# Altium schematic sheet Power_1.SchDoc
size A4; CompanyName: TH Nürnberg; Organization: UltraZohm; Address1: Kesslerplatz 12; Address2: 90489 Nürnberg; Address3: GERMANY; SheetNumber: 10; SheetTotal: 10
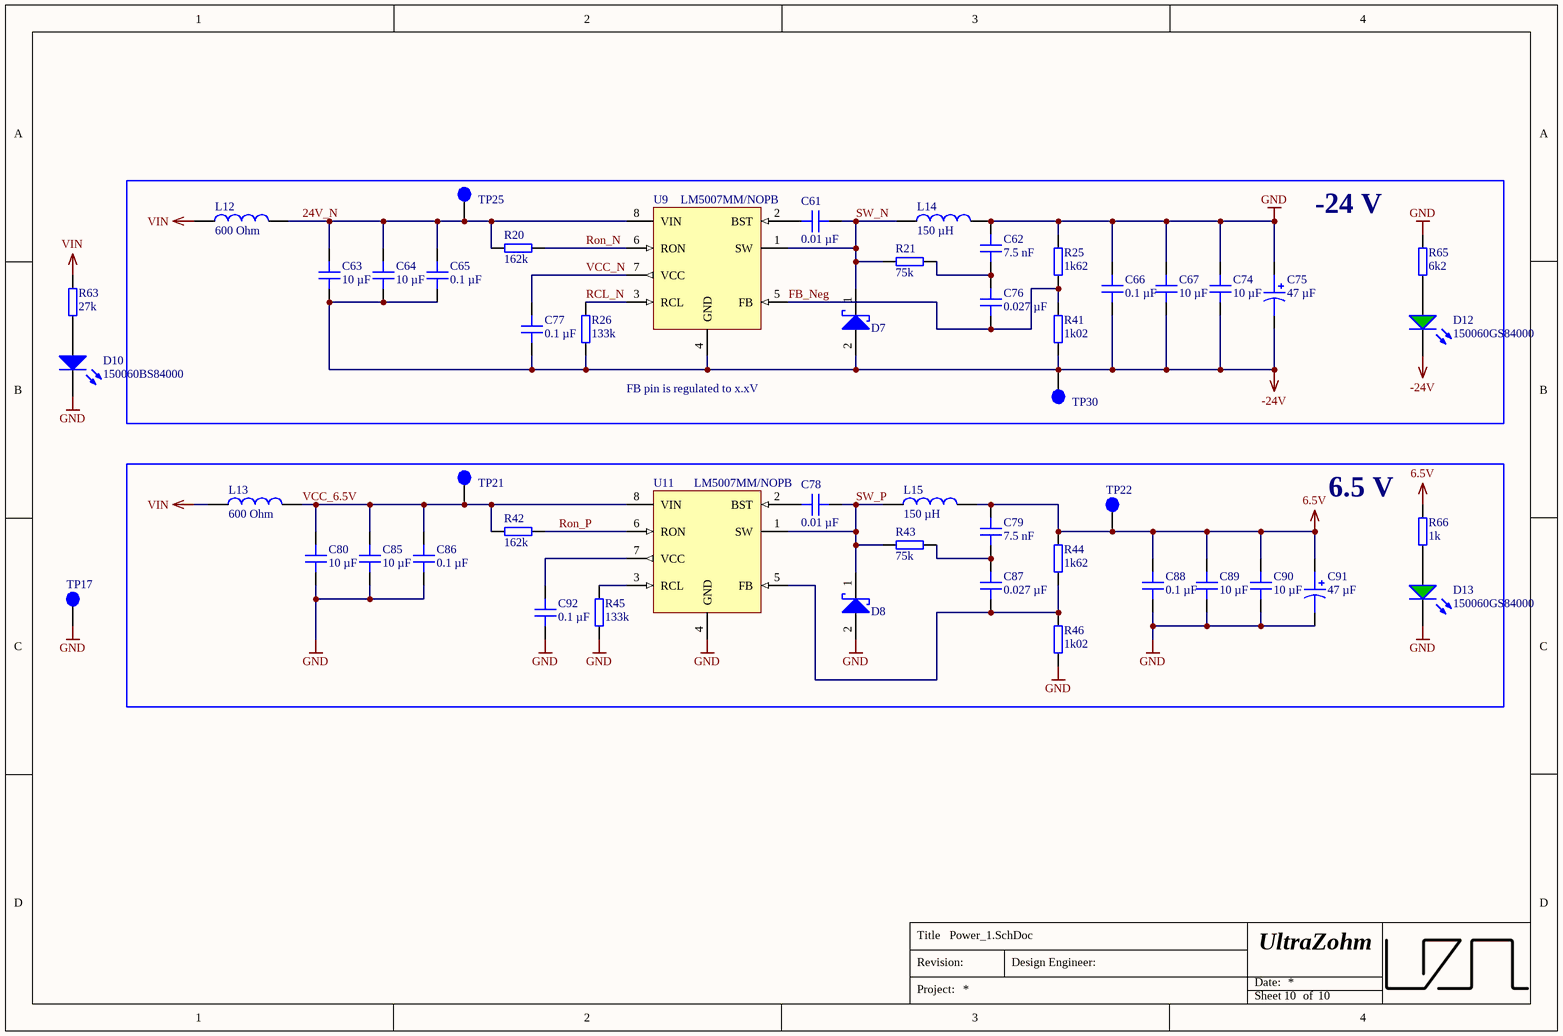
[diagram p0: Power_1.SchDoc]

## Parts
C61  0.01 µF  [C_0603]
C62  7.5 nF  [C_0603]
C63  10 µF  [C_1206]
C64  10 µF  [C_1206]
C65  0.1 µF  [C_0603]
C66  0.1 µF  [C_0603]
C67  10 µF  [C_1206]
C74  10 µF  [C_1206]
C75  47 µF  [CAPAE830X650N]
C76  0.027 µF  [C_0603]
C77  0.1 µF  [C_0603]
C78  0.01 µF  [C_0603]
C79  7.5 nF  [C_0603]
C80  10 µF  [C_1206]
C85  10 µF  [C_1206]
C86  0.1 µF  [C_0603]
C87  0.027 µF  [C_0603]
C88  0.1 µF  [C_0603]
C89  10 µF  [C_1206]
C90  10 µF  [C_1206]
C91  47 µF  [CAPAE830X650N]
C92  0.1 µF  [C_0603]
D7  BYS12-90-E3/TR3  [DIOM4227X23N]  (value not drawn)
D8  BYS12-90-E3/TR3  [DIOM4227X23N]  (value not drawn)
D10  150060BS84000  [WL-SMCW_0603]
D12  150060GS84000  [WL-SMCW_0603]
D13  150060GS84000  [WL-SMCW_0603]
L12  600 Ohm  [WE-CBF_0805_High Current]
L13  600 Ohm  [WE-CBF_0805_High Current]
L14  150 µH  [SMT_inductor_1050]
L15  150 µH  [SMT_inductor_1050]
R20  162k  [RES 0603_1608]
R21  75k  [RES 0603_1608]
R25  1k62  [RES 0603_1608]
R26  133k  [RES 0603_1608]
R41  1k02  [RES 0603_1608]
R42  162k  [RES 0603_1608]
R43  75k  [RES 0603_1608]
R44  1k62  [RES 0603_1608]
R45  133k  [RES 0603_1608]
R46  1k02  [RES 0603_1608]
R63  27k  [RES 0603_1608]
R65  6k2  [RES 0603_1608]
R66  1k  [RES 0603_1608]
TP17  -  [TP_1mm]  (value not drawn)
TP21  -  [TP_1mm]  (value not drawn)
TP22  -  [TP_1mm]  (value not drawn)
TP25  -  [TP_1mm]  (value not drawn)
TP30  -  [TP_1mm]  (value not drawn)
U9  LM5007MM/NOPB  [TSOP65P490X110-8N]
U11  LM5007MM/NOPB  [TSOP65P490X110-8N]

## Blocks framed on the sheet
-24 V: C61-C67 C74-C77 D7 D12 L12 L14 R20 R21 R25 R26 R41 R65 TP25 TP30 U9
6.5 V: C78-C80 C85-C92 D8 D13 L13 L15 R42-R46 R66 TP21 TP22 U11

## Nets
6.5V: C79.2 C88.2 C89.2 C90.2 C91.1 L15.2 R44.2 R66.2 TP22.1
-24V: C63.1 C64.1 C65.1 C66.1 C67.1 C74.1 C75.2 C77.1 D7.2(A) D12.1(K) R26.1 R41.1 TP30.1 U9.4(GND)
GND: C62.2 C66.2 C67.2 C74.2 C75.1 C80.1 C85.1 C86.1 C88.1 C89.1 C90.1 C91.2 C92.1 D8.2(A) D10.1(K) D13.1(K) L14.2 R25.2 R45.1 R46.1 R65.2 TP17.1 U11.4(GND)
VIN: L12.1 L13.1 R63.2
24V_N: C63.2 C64.2 C65.2 L12.2 R20.1 TP25.1 U9.8(VIN)
FB_Neg: C76.1 R25.1 R41.2 U9.5(FB)
RCL_N: R26.2 U9.3(RCL)
Ron_N: R20.2 U9.6(RON)
Ron_P: R42.2 U11.6(RON)
SW_N: C61.2 D7.1(K) L14.1 R21.1 U9.1(SW)
SW_P: C78.2 D8.1(K) L15.1 R43.1 U11.1(SW)
VCC_6.5V: C80.2 C85.2 C86.2 L13.2 R42.1 TP21.1 U11.8(VIN)
VCC_N: C77.2 U9.7(VCC)
NetC61_1: C61.1 U9.2(BST)
NetC62_1: C62.1 C76.2 R21.2
NetC78_1: C78.1 U11.2(BST)
NetC79_1: C79.1 C87.2 R43.2
NetC87_1: C87.1 R44.1 R46.2 U11.5(FB)
NetC92_2: C92.2 U11.7(VCC)
NetD10_2: D10.2(A) R63.1
NetD12_2: D12.2(A) R65.1
NetD13_2: D13.2(A) R66.1
NetR45_2: R45.2 U11.3(RCL)

## Notes on the sheet
- FB pin is regulated to x.xV
- Title
- Revision:
- Design Engineer:
- Date:
- Project:
- Sheet
- of

## Library data of the parts
C61 C78 = GCJ188R71H103KA01D: Capacitor 0603, 50 VDC, 0.01 µF, X7R; Manufacturer: muRata; Tolerance: 10 %; Voltage Rating: 50 VDC; Created from: MGremer; Manufacturer Part Number: GCJ188R71H103KA01D; PartID: 1; Created On: 20.12.2020 13:54:13; ComponentLink1Description: Datasheet; ComponentLink1URL: https://www.mouser.de/datasheet/2/281/c03e-516224.pdf; Component Type: Capacitor 0603; Device Package: 0603; Last Updated: 20.12.2020 16:24:16; Mounting Type: SMD; Operating Temperature: -55 - 125°C; Series: GCJ; Supplier 1: Mouser; Supplier Part Number 1: 81-GCJ188R71H103KA1D; Type: Capacitor; Value: 0.01 µF; Live Cycle Status: 1; Stock number: Labor SMD Container
C62 C79 = C0603C752J3GACTU: Capacitor 0603, 25 VDC, 7.5 nF, C0G; Manufacturer: KEMET; Tolerance: 5 %; Voltage Rating: 25 VDC; Created from: MGremer; Manufacturer Part Number: C0603C752J3GACTU; PartID: 52; Created On: 20.12.2020 13:54:13; ComponentLink1Description: Datasheet; ComponentLink1URL: https://www.mouser.de/datasheet/2/212/KEM_C1003_C0G_SMD-1101588.pdf; Component Type: Capacitor 0603; Device Package: 0603; Last Updated: 20.12.2020 16:43:29; Mounting Type: SMD; Operating Temperature: -55 - 125°C; Series: SMD Comm C0G; Supplier 1: Mouser; Supplier Part Number 1: 80-C0603C752J3GACTU; Type: Capacitor; Value: 7.5 nF; Live Cycle Status: 1; Stock number: not stored
C63 C64 C67 C74 C80 C85 C89 C90 = 1206DD106MAT2A: Capacitor 1206, 35 VDC, 10 µF, X5R; Manufacturer: AVX; Tolerance: 20%; Voltage Rating: 35 VDC; Created from: MGremer; Manufacturer Part Number: 1206DD106MAT2A; PartID: 49; Created On: 20.12.2020 13:54:13; ComponentLink1Description: Datasheet; ComponentLink1URL: https://www.mouser.de/datasheet/2/40/cx5r-776519.pdf; Component Type: Capacitor 1206; Device Package: 1206; Last Updated: 20.12.2020 17:44:37; Mounting Type: SMD; Operating Temperature: -55 - 85°C; Series: X5R; Supplier 1: Mouser; Supplier Part Number 1: 581-1206DD106MAT2A; Type: Capacitor; Value: 10 µF; Live Cycle Status: 1; Stock number: not stored
C65 C66 C77 C86 C88 C92 = C0603X104K5RAC7411: Capacitor 0603, 50 VDC, 0.1 µF, X7R; Manufacturer: KEMET; Tolerance: 10 %; Voltage Rating: 50 VDC; Created from: MGremer; Manufacturer Part Number: C0603X104K5RAC7411; PartID: 3; Created On: 20.12.2020 13:54:13; ComponentLink1Description: Datasheet; ComponentLink1URL: https://www.mouser.de/datasheet/2/212/1/KEM_C1013_X7R_FT_CAP_SMD-1103280.pdf; Component Type: Capacitor 0603; Device Package: 0603; Last Updated: 04.03.2021 09:24:28; Mounting Type: SMD; Operating Temperature: -55 - 125°C; Series: SMD Comm X7R Flex; Supplier 1: Mouser; Supplier Part Number 1: 80-C0603X104K5R7411; Supplier 2: LCSC; Supplier Part Number 2: C14663; Type: Capacitor; Value: 0.1 µF; Live Cycle Status: 1; LCSC Part Number: C14663; Stock number: Labor SMD Container
C75 C91 = EEE-1VA470P: Capacitor, 47µF, 35VDC Al Electrolyt; Manufacturer: Panasonic; Tolerance: 20 %; Created from: T. Wendt; Manufacturer Part Number: EEE-1VA470P; PartID: 63; Created On: 26.02.2021 15:32:07; ComponentLink1Description: Datasheet; ComponentLink1URL: https://industrial.panasonic.com/cdbs/www-data/pdf/RDE0000/ABA0000C1145.pdf; Component Type: Capacitor Al Electrolyt; Last Updated: 04.03.2021 09:24:01; Mounting Type: SMD; Operating Temperature: -40 - 85°C; Series: S Series; Supplier 1: Mouser; Supplier Part Number 1: 667-EEE-1VA470P; Supplier 2: LCSC; Supplier Part Number 2: C336247; Type: Capacitor; Voltage Rating: 35 VDC; Value: 47 µF; Live Cycle Status: 1; LCSC Part Number: C336247; Stock number: not stored
C76 C87 = 06035C273J4T2A: Capacitor 0603, 50 VDC, 27 nF, X7R; Manufacturer: AVX; Tolerance: 5 %; Voltage Rating: 50 VDC; Created from: MGremer; Manufacturer Part Number: 06035C273J4T2A; PartID: 81; Created On: 20.12.2020 13:54:13; ComponentLink1Description: Datasheet; ComponentLink1URL: https://www.mouser.de/datasheet/2/40/AutoMLCC-777028.pdf; Component Type: Capacitor 0603; Device Package: 0603; Last Updated: 20.01.2021 13:57:36; Mounting Type: SMD; Operating Temperature: -55 - 125°C; Series: AutoMLCC X7R; Supplier 1: Mouser; Supplier Part Number 1: 581-06035C273J4T2A; Type: Capacitor; Value: 0.027 µF; Live Cycle Status: 1; Stock number: not stored
D7 D8 = BYS12-90-E3/TR3: Schottky Rectifier, 1.5 A, 90 V; Manufacturer: Vishay General Semiconductor; Forward Current: 1.5 A; Forward Voltage: 0.75 V; Reverse Current: 100 µA; Created from: MGremer; Manufacturer Part Number: BYS12-90-E3/TR3; PartID: 2; Created On: 06.01.2021 14:34:10; ComponentLink1Description: Datasheet; ComponentLink1URL: https://www.mouser.de/datasheet/2/427/bys12_90-1768074.pdf; Component Type: Schottky Rectifier; Device Package: SMA; Last Updated: 18.01.2021 16:09:20; Mounting Type: SMD; Operating Temperature: -55 - 150 °C; Supplier 1: Mouser; Supplier Part Number 1: 625-BYS12-90-E3/TR3; Type: Schottky Rectifier; Value: -; Live Cycle Status: 1; Stock number: not stored
D10 = 150060BS84000: WL-SMCW SMD Mono-color Chip LED Waterclear Blue; Manufacturer: Wuerth Elektronik; Type: Standard; Created from: MGremer; Forward Current I_f: 20 mA; Forward Voltage U_f: 3.2 V; Wavelength: 470 nm; Light Intensity: 560 mcd; Nominal Power: 78 mW; Manufacturer Part Number: 150060BS84000; PartID: 1; Created On: 08.12.2020 10:19:38; ComponentLink1Description: Datasheet; ComponentLink1URL: https://www.mouser.de/datasheet/2/445/150060BS84000-1838909.pdf; Component Type: LED Diode; Device Package: 0603; Last Updated: 03.03.2021 09:59:51; Mounting Type: SMD; Operating Temperature: -40 - 85 °C; Supplier 1: Mouser; Supplier Part Number 1: 710-150060BS84000; Supplier 2: Farnell; Supplier Part Number 2: 3408611; Supplier 3: Digi-Key; Supplier Part Number 3: 732-150060BS84000CT-ND; Live Cycle Status: 1; Stock number: not stored; Color: blue
D12 D13 = 150060GS84000: WL-SMCW SMD Mono-color Chip LED Waterclear Green; Manufacturer: Wuerth Elektronik; Type: Standard; Created from: MGremer; Forward Current I_f: 20 mA; Forward Voltage U_f: 3.2 V; Wavelength: 525 nm; Light Intensity: 3000 mcd; Nominal Power: 78 mW; Manufacturer Part Number: 150060GS84000; PartID: 2; Created On: 08.12.2020 10:41:11; ComponentLink1Description: Datasheet; ComponentLink1URL: https://www.mouser.de/datasheet/2/445/150060GS75020-1714345.pdf; Component Type: LED Diode; Device Package: 0603; Last Updated: 03.03.2021 09:59:51; Mounting Type: SMD; Operating Temperature: -40 - 85 °C; Supplier 1: Mouser; Supplier Part Number 1: 710-150060GS84000; Supplier 2: Farnell; Supplier Part Number 2: 3408612; Supplier 3: Digi-Key; Supplier Part Number 3: 732-150060GS84000CT-ND; Live Cycle Status: 1; Stock number: not stored; Color: green
L12 L13 = 742792040: Inductance, 0805, 100 MHz, 600 Ohm, 2 A; Manufacturer: Wurth Elektronik; Type: Inductance SMD; DC current: 2 A; Created from: MGremer; Manufacturer Part Number: 742792040; PartID: 1; Created On: 18.01.2021 14:53:17; ComponentLink1Description: Datasheet; ComponentLink1URL: https://www.mouser.de/datasheet/2/445/742792040-1720361.pdf; Component Type: Inductance; Device Package: 0805; Last Updated: 18.01.2021 14:53:25; Mounting Type: SMD; Operating Temperature: -55 - 125 °C; Series: WE-CBF; Supplier 1: Mouser; Supplier Part Number 1: 710-742792040; Value: 600 Ohm; Live Cycle Status: 1; Stock number: not stored
L14 L15 = B82464G4154M: Inductor SMT, 10 x 10, 150 µH, 0.8 A; Manufacturer: TDK; MF: EPCOS / TDK; DCR: 320m; Rated Current: 0.85 A; DC current: 0.8 A; Created from: MGremer; MPN: B82464G4154M; Supplier 1: Mouser; Supplier Part Number 1: 871-B82464G4154M; Value: 150 µH; Manufacturer Part Number: B82464G4154M; PartID: 5; Created On: 08.06.2021 11:33:39; ComponentLink1Description: Datasheet; ComponentLink1URL: https://www.tdk-electronics.tdk.com/inf/30/db/ind_2008/b82464g4.pdf; Component Type: Inductor; Device Package: 10.4 x 10.4 x 4.8 (mm); Last Updated: 24.08.2021 15:23:28; Mounting Type: SMD; Operating Temperature: -55 - 125 °C; Series: B82464G; Type: Inductor; Live Cycle Status: 1; Stock number: not stored
R20 R42 = CR0603-FX-1623ELF: SMD resistor 1%; Manufacturer: Burns; Created from: MGremer; Manufacturer Part Number: CR0603-FX-1623ELF; PartID: 165; Created On: 14.12.2020 16:17:14; ComponentLink1Description: Datasheet; ComponentLink1URL: https://www.mouser.de/datasheet/2/54/crxxxxx-1858361.pdf; Component Type: SMD resistor; Device Package: 0603; Last Updated: 02.03.2021 14:07:32; Mounting Type: SMD; Supplier 1: Mouser; Supplier Part Number 1: 652-CR0603-FX1623ELF; Type: Resistor; Tolerance: 1%; Value: 162k; Live Cycle Status: 1; Stock number: not stored
R21 R43 = RK73B1JTTD753J: SMD resistor E24 series; Manufacturer: KOA Speer; Tolerance: 5%; Created from: MGremer; Manufacturer Part Number: RK73B1JTTD753J; PartID: 119; Created On: 14.12.2020 16:17:14; ComponentLink1Description: Datasheet; ComponentLink1URL: https://www.mouser.de/datasheet/2/219/RK73B-1825463.pdf; Component Type: SMD resistor; Device Package: 0603; Last Updated: 02.03.2021 14:07:32; Mounting Type: SMD; Supplier 1: Mouser; Supplier Part Number 1: 660-RK73B1JTTD753J; Type: Resistor; Value: 75k; Live Cycle Status: 1; Stock number: Labor SMD Container
R25 R44 = ERJ-P03F1621V: SMD resistor 1%; Manufacturer: Panasonic; Created from: MGremer; Manufacturer Part Number: ERJ-P03F1621V; PartID: 191; Created On: 14.12.2020 16:17:14; ComponentLink1Description: Datasheet; ComponentLink1URL: https://www.mouser.de/datasheet/2/315/AOA0000C331-1141874.pdf; Component Type: SMD resistor; Device Package: 0603; Last Updated: 02.07.2021 11:49:34; Mounting Type: SMD; Supplier 1: Mouser; Supplier Part Number 1: 667-ERJ-P03F1621V; Type: Resistor; Tolerance: 1%; Value: 1k62; Live Cycle Status: 1; Stock number: not stored
R26 R45 = CR0603-FX-1333ELF: SMD resistor 1%; Manufacturer: Burns; Created from: MGremer; Manufacturer Part Number: CR0603-FX-1333ELF; PartID: 166; Created On: 14.12.2020 16:17:14; ComponentLink1Description: Datasheet; ComponentLink1URL: https://www.mouser.de/datasheet/2/54/crxxxxx-1858361.pdf; Component Type: SMD resistor; Device Package: 0603; Last Updated: 02.03.2021 14:07:32; Mounting Type: SMD; Supplier 1: Mouser; Supplier Part Number 1: 652-CR0603FX-1333ELF; Type: Resistor; Tolerance: 1%; Value: 133k; Live Cycle Status: 1; Stock number: not stored
R41 R46 = CR0603-FX-1021ELF: SMD resistor 1%; Manufacturer: Burns; Created from: MGremer; Manufacturer Part Number: CR0603-FX-1021ELF; PartID: 168; Created On: 14.12.2020 16:17:14; ComponentLink1Description: Datasheet; ComponentLink1URL: https://www.mouser.de/datasheet/2/54/crxxxxx-1858361.pdf; Component Type: SMD resistor; Device Package: 0603; Last Updated: 02.03.2021 14:07:32; Mounting Type: SMD; Supplier 1: Mouser; Supplier Part Number 1: 652-CR0603FX-1021ELF; Type: Resistor; Tolerance: 1%; Value: 1k02; Live Cycle Status: 1; Stock number: not stored
R63 = RK73B1JTTD273J: SMD resistor E24 series; Manufacturer: KOA Speer; Tolerance: 5%; Created from: MGremer; Manufacturer Part Number: RK73B1JTTD273J; PartID: 108; Created On: 14.12.2020 16:17:14; ComponentLink1Description: Datasheet; ComponentLink1URL: https://www.mouser.de/datasheet/2/219/RK73B-1825463.pdf; Component Type: SMD resistor; Device Package: 0603; Last Updated: 02.03.2021 14:07:32; Mounting Type: SMD; Supplier 1: Mouser; Supplier Part Number 1: 660-RK73B1JTTD273J; Type: Resistor; Value: 27k; Live Cycle Status: 1; Stock number: Labor SMD Container
R65 = RK73B1JTTD622J: SMD resistor E24 series; Manufacturer: KOA Speer; Tolerance: 5%; Created from: MGremer; Manufacturer Part Number: RK73B1JTTD622J; PartID: 93; Created On: 14.12.2020 16:17:14; ComponentLink1Description: Datasheet; ComponentLink1URL: https://www.mouser.de/datasheet/2/219/RK73B-1825463.pdf; Component Type: SMD resistor; Device Package: 0603; Last Updated: 02.03.2021 14:07:32; Mounting Type: SMD; Supplier 1: Mouser; Supplier Part Number 1: 660-RK73B1JTTD622J; Type: Resistor; Value: 6k2; Live Cycle Status: 1; Stock number: Labor SMD Container
R66 = RK73B1JTTDD102J: SMD resistor E24 series; Manufacturer: KOA Speer; Tolerance: 5%; Created from: MGremer; Manufacturer Part Number: RK73B1JTTDD102J; PartID: 74; Created On: 14.12.2020 16:17:14; ComponentLink1Description: Datasheet; ComponentLink1URL: https://www.mouser.de/datasheet/2/219/RK73B-1825463.pdf; Component Type: SMD resistor; Device Package: 0603; Last Updated: 02.03.2021 14:07:32; Mounting Type: SMD; Supplier 1: Mouser; Supplier Part Number 1: 660-RK73B1JTTDD102J; Type: Resistor; Value: 1k; Live Cycle Status: 1; Stock number: Labor SMD Container
TP17 TP21 TP22 TP25 TP30 = -: Test Point 1 mm; Value: TP; Created from: MGremer; Created: 2018_06_25_AGeiger; Manufacturer Part Number: -; PartID: 9; Created On: 02.03.2021 14:59:37; ComponentLink1Description: Datasheet; ComponentLink1URL: -; ComponentLink2Description: Homepage; ComponentLink2URL: -; Component Type: Test Point; Device Package: SMD; Last Updated: 08.10.2021 21:16:06; Manufacturer: -; Minimum Order: 1; Mounting Type: SMD; Supplier 1: -; Supplier Part Number 1: -; Type: Test point; Live Cycle Status: 1; Stock number: not stored
U9 U11 = LM5007MM/NOPB: Buck Converter with 80 V integrated Power MOSFET, U_in 9 V - 75 V, U_out 2.5 V - 73 V, I_out 500 mA; Manufacturer: Texas Instruments; Value: 500 mA; Created from: MGremer; Manufacturer Part Number: LM5007MM/NOPB; PartID: 7; Created On: 06.01.2021 09:48:37; ComponentLink1Description: Datasheet; ComponentLink1URL: https://www.ti.com/general/docs/suppproductinfo.tsp?distId=26&gotoUrl=http%3A%2F%2Fwww.ti.com%2Flit%2Fgpn%2Flm5007; Component Type: Buck Converter; Device Package: -; Last Updated: 15.02.2021 10:14:22; Mounting Type: SMD; Series: LM5007; Supplier 1: Mouser; Supplier Part Number 1: 926-LM5007MM/NOPB; Type: Buck Converter; Live Cycle Status: 1; Stock number: not stored